# Altium schematic sheet Main.SchDoc
size A4; SheetNumber: 1; SheetTotal: 4
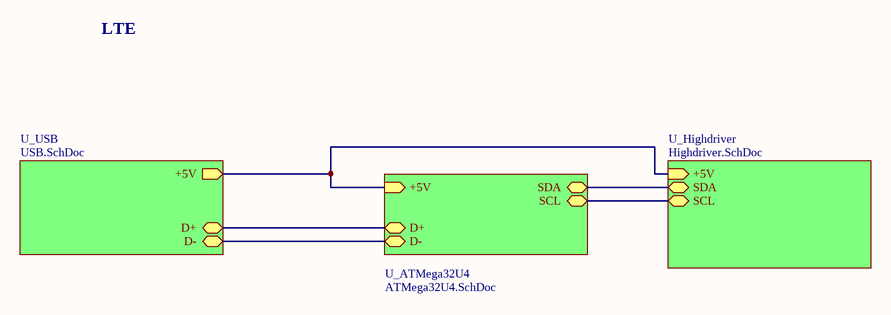
[diagram p0: Main.SchDoc]

## Parts
Bartunik  Gültig ab 5.3.18!!!  [lteLogoNeu_6mm]  (value not drawn)  (no BOM)

## Sub-sheets
U_ATMega32U4 = ATMega32U4.SchDoc: D+ (bidir), D- (bidir), SDA (bidir), SCL (bidir), +5V (in)
U_Highdriver = Highdriver.SchDoc: SCL (bidir), +5V (in), SDA (bidir)
U_USB = USB.SchDoc: D+ (bidir), D- (bidir), +5V (out)

## Nets
(unnamed): sheet U_USB/D+, sheet U_ATMega32U4/D+
(unnamed): sheet U_USB/D-, sheet U_ATMega32U4/D-
(unnamed): sheet U_USB/+5V, sheet U_ATMega32U4/+5V, sheet U_Highdriver/+5V
(unnamed): sheet U_ATMega32U4/SDA, sheet U_Highdriver/SDA
(unnamed): sheet U_ATMega32U4/SCL, sheet U_Highdriver/SCL

## Library data of the parts
Bartunik = ltelogoNEU: Manufactor: LTE; Part Number: ltelogoNEU; Supplier 1: LTE